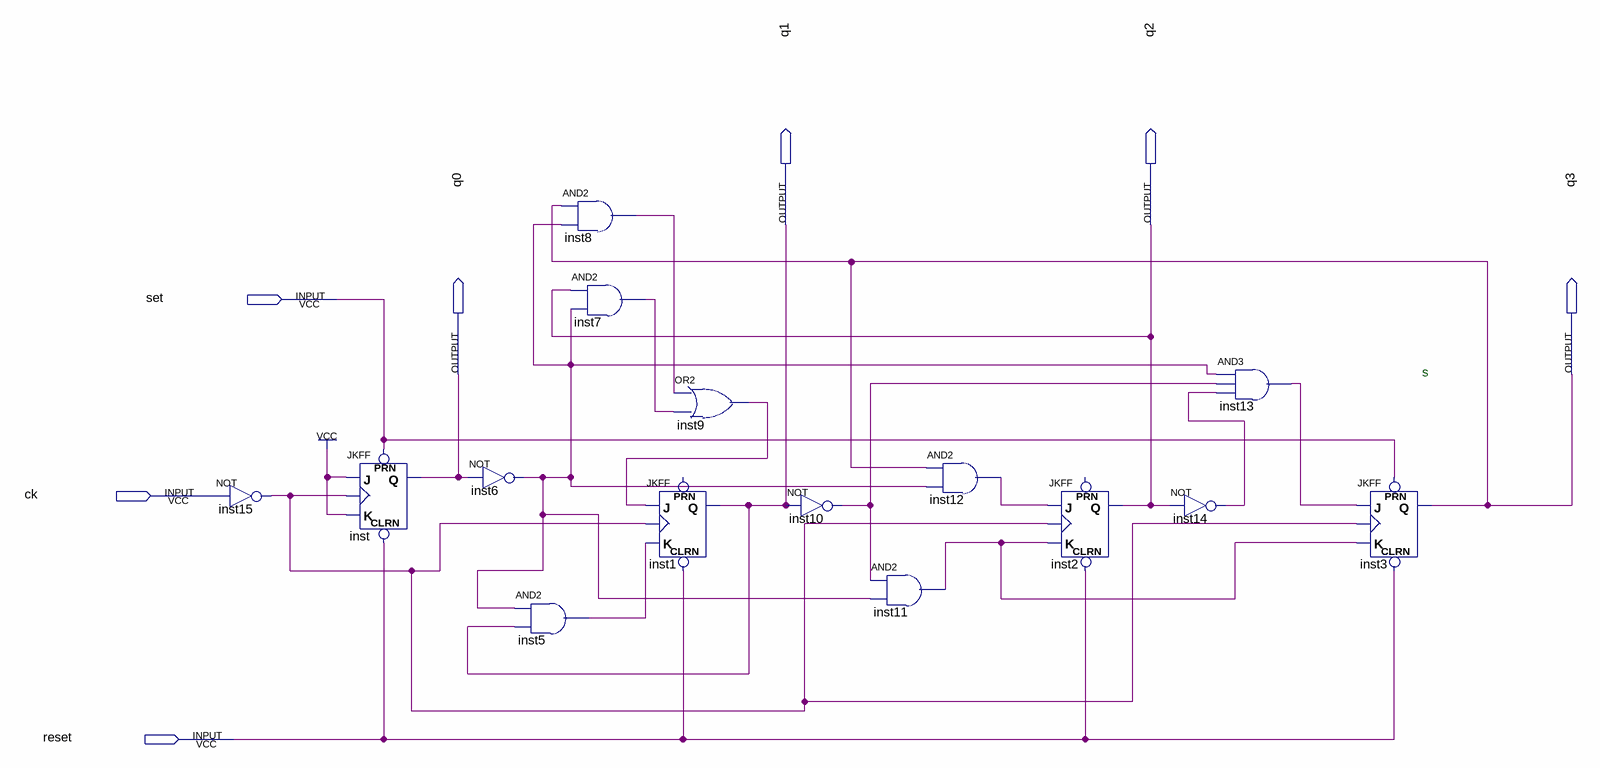
[diagram p0: schematic sheet]
// Quartus schematic numinvers10.bdf as structural Verilog: 15 symbols, 7 pins
module numinvers10 (
  input  set,
  input  ck,
  input  reset,
  output q1,
  output q2,
  output q0,
  output q3
);

  wire inst5_out, inst6_out, inst7_out, inst8_out, inst9_out, inst10_out, inst11_out, inst12_out, inst13_out,
       inst14_out, inst15_out;

  not inst15 (inst15_out, ck);
  JKFF inst (.PRN(set), .CLRN(reset), .K(1'b1), .J(1'b1), .CLK(inst15_out), .Q(q0));
  not inst6 (inst6_out, q0);
  and inst5 (inst5_out, inst6_out, q1);
  and inst8 (inst8_out, q3, inst6_out);
  and inst7 (inst7_out, q2, inst6_out);
  or inst9 (inst9_out, inst8_out, inst7_out);
  JKFF inst1 (.CLRN(reset), .K(inst5_out), .J(inst9_out), .CLK(inst15_out), .Q(q1));  // open: PRN
  not inst10 (inst10_out, q1);
  and inst11 (inst11_out, inst10_out, inst6_out);
  and inst12 (inst12_out, q3, inst6_out);
  JKFF inst2 (.CLRN(reset), .K(inst11_out), .J(inst12_out), .CLK(inst15_out), .Q(q2));  // open: PRN
  not inst14 (inst14_out, q2);
  and inst13 (inst13_out, inst6_out, inst10_out, inst14_out);
  JKFF inst3 (.PRN(set), .CLRN(reset), .K(inst11_out), .J(inst13_out), .CLK(inst15_out), .Q(q3));

  // Notes on the sheet:
  //   s
endmodule
